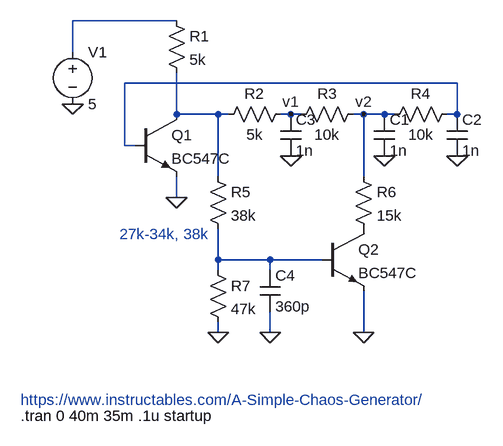
[diagram p0: schematic 5minutechaos.asc]
5minutechaos.asc, the LTspice schematic file:
Version 4
SHEET 1 880 680
WIRE 128 -32 -32 -32
WIRE -32 16 -32 -32
WIRE 560 64 48 64
WIRE 128 112 128 48
WIRE 192 112 128 112
WIRE 208 112 192 112
WIRE 304 112 288 112
WIRE 320 112 304 112
WIRE 416 112 400 112
WIRE 448 112 416 112
WIRE 464 112 448 112
WIRE 560 112 560 64
WIRE 560 112 544 112
WIRE 48 160 48 64
WIRE 64 160 48 160
WIRE 192 208 192 112
WIRE 416 208 416 112
WIRE 128 240 128 208
WIRE 192 336 192 288
WIRE 272 336 192 336
WIRE 352 336 272 336
WIRE 192 352 192 336
WIRE 272 352 272 336
WIRE 192 448 192 432
WIRE 272 448 272 416
WIRE 416 448 416 384
FLAG 128 240 0
FLAG 304 176 0
FLAG 448 176 0
FLAG 560 176 0
FLAG 192 448 0
FLAG 272 448 0
FLAG 416 448 0
FLAG -32 96 0
FLAG 304 112 v1
FLAG 416 112 v2
SYMBOL npn 64 112 R0
SYMATTR InstName Q1
SYMATTR Value BC547C
SYMBOL res 112 -48 R0
SYMATTR InstName R1
SYMATTR Value 5k
SYMBOL res 304 96 R90
WINDOW 0 0 56 VBottom 2
WINDOW 3 32 56 VTop 2
SYMATTR InstName R2
SYMATTR Value 5k
SYMBOL res 416 96 R90
WINDOW 0 0 56 VBottom 2
WINDOW 3 32 56 VTop 2
SYMATTR InstName R3
SYMATTR Value 10k
SYMBOL res 560 96 R90
WINDOW 0 0 56 VBottom 2
WINDOW 3 32 56 VTop 2
SYMATTR InstName R4
SYMATTR Value 10k
SYMBOL cap 432 112 R0
SYMATTR InstName C1
SYMATTR Value 1n
SYMBOL cap 544 112 R0
SYMATTR InstName C2
SYMATTR Value 1n
SYMBOL cap 288 112 R0
SYMATTR InstName C3
SYMATTR Value 1n
SYMBOL res 176 192 R0
SYMATTR InstName R5
SYMATTR Value 38k
SYMBOL res 400 192 R0
SYMATTR InstName R6
SYMATTR Value 15k
SYMBOL npn 352 288 R0
SYMATTR InstName Q2
SYMATTR Value BC547C
SYMBOL cap 256 352 R0
SYMATTR InstName C4
SYMATTR Value 360p
SYMBOL res 176 336 R0
SYMATTR InstName R7
SYMATTR Value 47k
SYMBOL voltage -32 0 R0
WINDOW 123 0 0 Left 0
WINDOW 39 0 0 Left 0
SYMATTR InstName V1
SYMATTR Value 5
TEXT -112 552 Left 2 ;https://www.instructables.com/A-Simple-Chaos-Generator/
TEXT -112 576 Left 2 !.tran 0 40m 35m .1u startup
TEXT 40 296 Left 2 ;27k-34k, 38k

The netlist it stands for:
* 5minutechaos.asc
Q1 N003 N002 0 0 BC547C
R1 N001 N003 5k
R2 v1 N003 5k
R3 v2 v1 10k
R4 N002 v2 10k
C1 v2 0 1n
C2 N002 0 1n
C3 v1 0 1n
R5 N003 N004 38k
R6 v2 P001 15k
Q2 P001 N004 0 0 BC547C
C4 N004 0 360p
R7 N004 0 47k
V1 N001 0 5
.model NPN NPN
.model PNP PNP
.lib standard.bjt
* https://www.instructables.com/A-Simple-Chaos-Generator/
.tran 0 40m 35m .1u startup
* 27k-34k, 38k
.backanno
.end